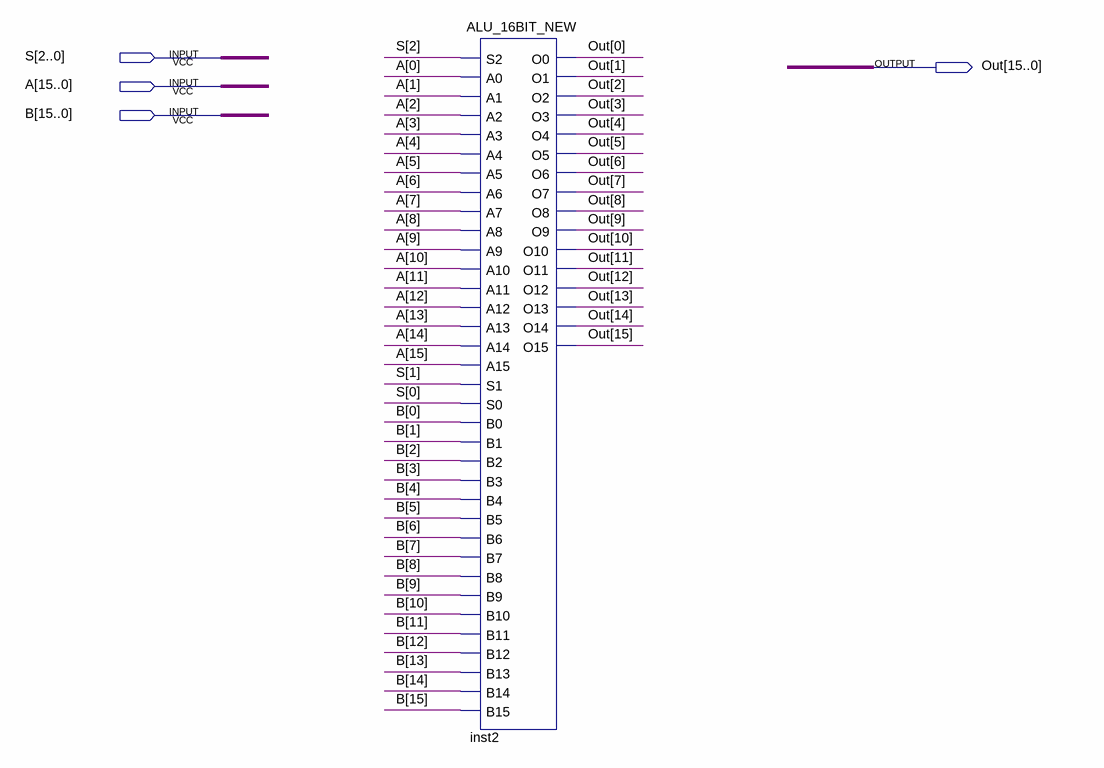
[diagram p0: schematic sheet]
// Quartus schematic ALU_16bit_Optimized_Design.bdf as structural Verilog: 1 symbols, 4 pins
module ALU_16bit_Optimized_Design (
  input  [2:0] S,
  input  [15:0] A,
  input  [15:0] B,
  output [15:0] Out
);

  ALU_16BIT_NEW inst2 (
    .S2(S[2]), .A0(A[0]), .A1(A[1]), .A2(A[2]), .A3(A[3]), .A4(A[4]), .A5(A[5]), .A6(A[6]), .A7(A[7]),
    .A8(A[8]), .A9(A[9]), .A10(A[10]), .A11(A[11]), .A12(A[12]), .A13(A[13]), .A14(A[14]), .A15(A[15]),
    .S1(S[1]), .S0(S[0]), .B0(B[0]), .B1(B[1]), .B2(B[2]), .B3(B[3]), .B4(B[4]), .B5(B[5]), .B6(B[6]),
    .B7(B[7]), .B8(B[8]), .B9(B[9]), .B10(B[10]), .B11(B[11]), .B12(B[12]), .B13(B[13]), .B14(B[14]),
    .B15(B[15]), .O0(Out[0]), .O1(Out[1]), .O2(Out[2]), .O3(Out[3]), .O4(Out[4]), .O5(Out[5]), .O6(Out[6]),
    .O7(Out[7]), .O8(Out[8]), .O9(Out[9]), .O10(Out[10]), .O11(Out[11]), .O12(Out[12]), .O13(Out[13]),
    .O14(Out[14]), .O15(Out[15]));
endmodule
